# EAGLE design Control pHAT v0.1A (EAGLE 9.3.1)
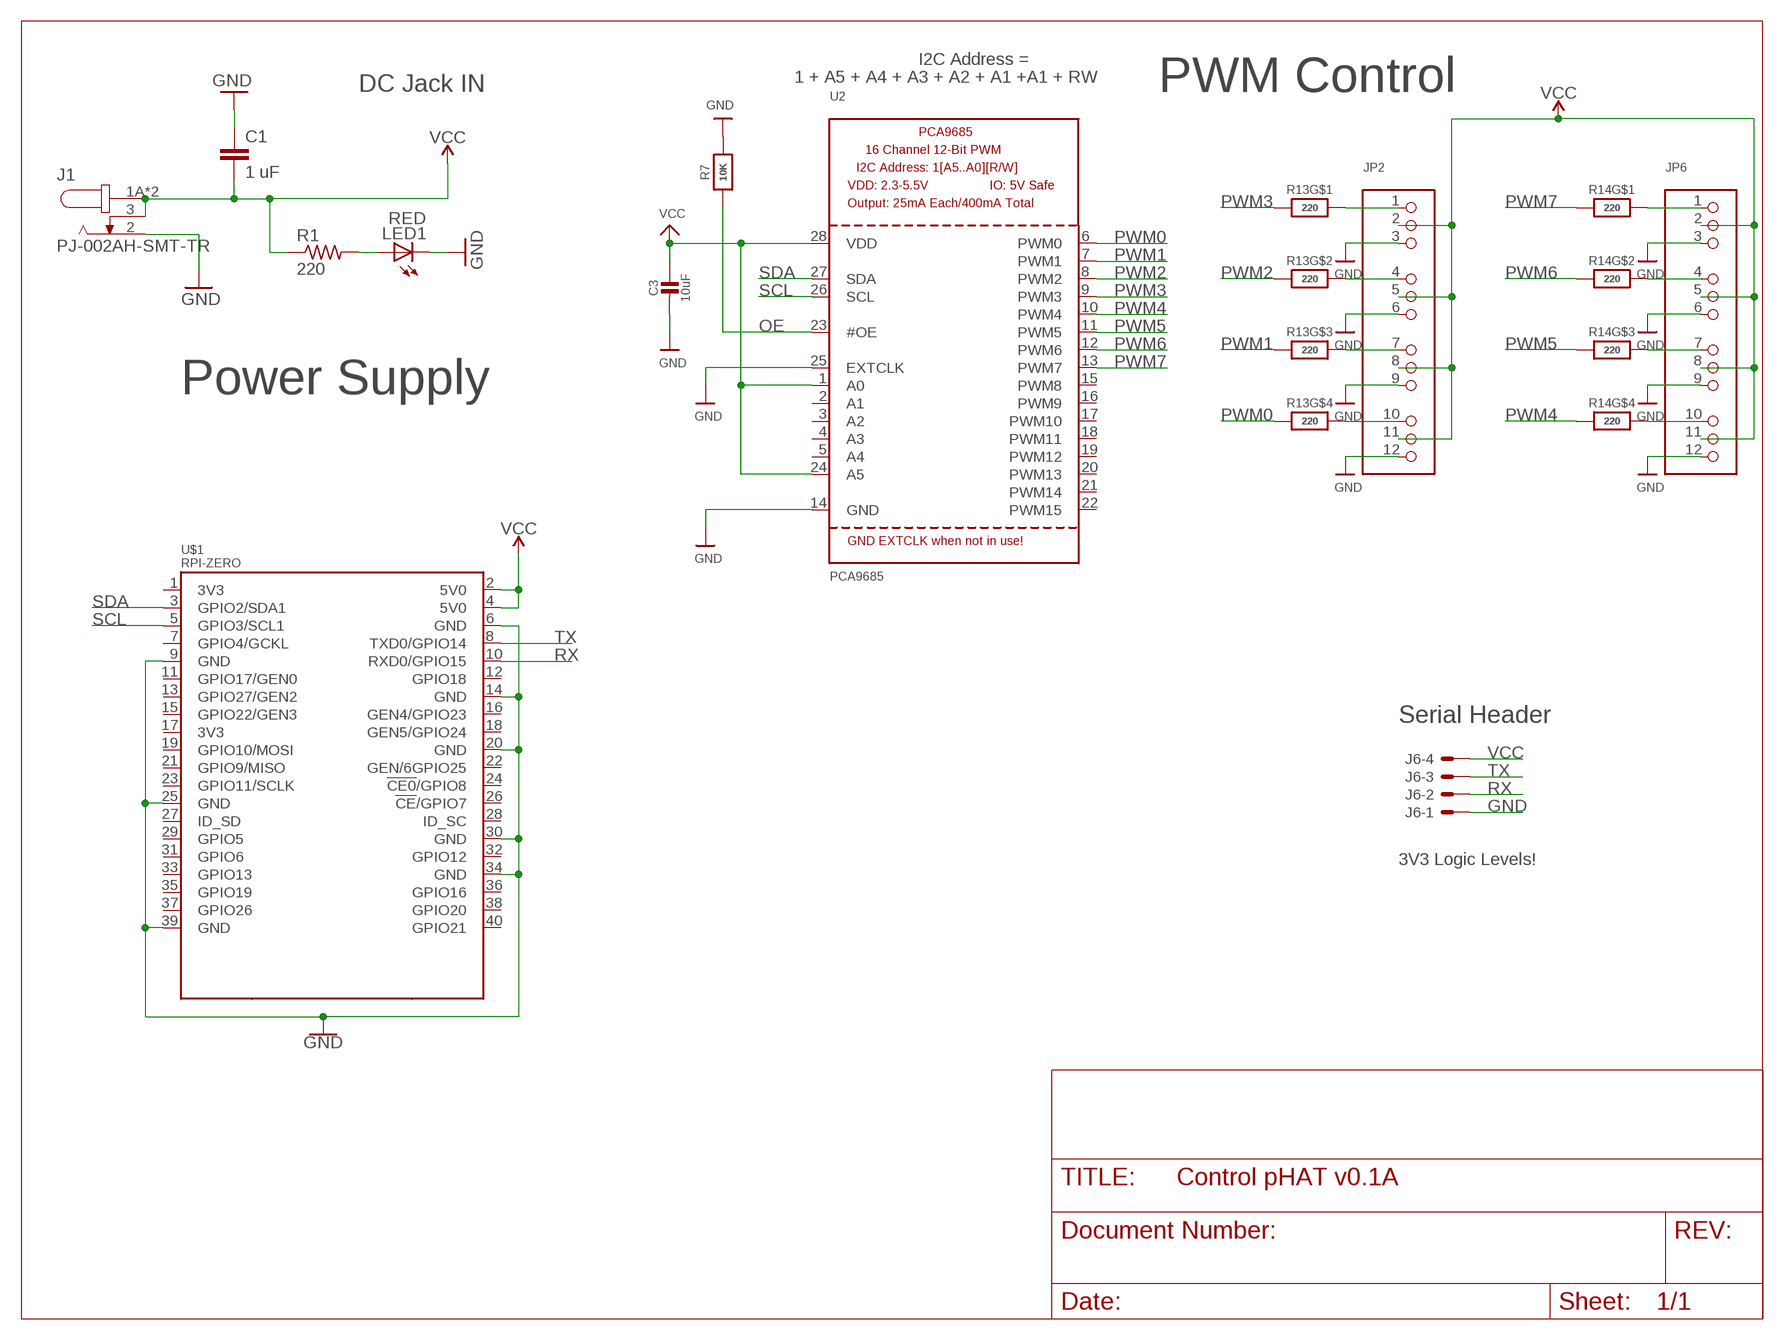
[diagram p0: schematic, sheet 1]

## Parts
C1  1 uF  C-EUC0603  [C0603]
C3  10uF  CAP_CERAMIC0805-NOOUTLINE  [0805-NO]
J1  PJ-002AH-SMT-TR  [CUI_PJ-002AH-SMT-TR]
J6  JST-XH-04-PIN-LONG-PAD  [JST-XH-04-PACKAGE-LONG-PAD]
JP2  HEADER-3X04  [3X04]
JP6  HEADER-3X04  [3X04]
LED1  RED  LEDCHIP-LED0603  [CHIP-LED0603]
R1  220  R-US_M1206  [M1206]
R7  10K  RESISTOR0805_NOOUTLINE  [0805-NO]
R13  220  RESISTOR_4PACK  [RESPACK_4X0603]
R14  220  RESISTOR_4PACK  [RESPACK_4X0603]
U2  PCA9685  [TSSOP28]
U$1  RPI-ZERO  [RASPBERRYPI_BASTELSTUBE_V13_RASPI_BOARD_B+_FULL]

## Nets
GND: C1.1 C3.2 J1.2 J6.1 JP2.3 JP2.6 JP2.9 JP2.12 JP6.3 JP6.6 JP6.9 JP6.12 LED1.C R7.2 U2.14(GND) U2.25(EXTCLK)
GND@1: U$1.6(GND) U$1.9(GND) U$1.14(GND) U$1.20(GND) U$1.25(GND) U$1.30(GND) U$1.34(GND) U$1.39(GND) ; supply symbol labelled GND
N$3: JP2.1 R13.8
N$4: LED1.A R1.2
N$5: JP2.4 R13.7
N$9: JP2.7 R13.6
N$10: JP2.10 R13.5
N$11: JP6.10 R14.5
N$12: JP6.7 R14.6
N$13: JP6.4 R14.7
N$14: JP6.1 R14.8
OE: R7.1 U2.23(#OE)
PWM0: R13.4 U2.6(PWM0)
PWM1: R13.3 U2.7(PWM1)
PWM2: R13.2 U2.8(PWM2)
PWM3: R13.1 U2.9(PWM3)
PWM4: R14.4 U2.10(PWM4)
PWM5: R14.3 U2.11(PWM5)
PWM6: R14.2 U2.12(PWM6)
PWM7: R14.1 U2.13(PWM7)
RX: J6.2 U$1.10(RXD0/GPIO15)
SCL: U2.26(SCL) U$1.5(GPIO3/SCL1)
SDA: U2.27(SDA) U$1.3(GPIO2/SDA1)
TX: J6.3 U$1.8(TXD0/GPIO14)
VCC: C1.2 C3.1 J1.1A J1.1B J1.3 J6.4 JP2.2 JP2.5 JP2.8 JP2.11 JP6.2 JP6.5 JP6.8 JP6.11 R1.1 U2.1(A0) U2.24(A5) U2.28(VDD) U$1.2(5V0) U$1.4(5V0)
Unconnected: U2.2(A1) U2.3(A2) U2.4(A3) U2.5(A4) U2.15(PWM8) U2.16(PWM9) U2.17(PWM10) U2.18(PWM11) U2.19(PWM12) U2.20(PWM13) U2.21(PWM14) U2.22(PWM15) U$1.1(3V3) U$1.7(GPIO4/GCKL) U$1.11(GPIO17/GEN0) U$1.12(GPIO18) U$1.13(GPIO27/GEN2) U$1.15(GPIO22/GEN3) U$1.16(GEN4/GPIO23) U$1.17(3V3) U$1.18(GEN5/GPIO24) U$1.19(GPIO10/MOSI) U$1.21(GPIO9/MISO) U$1.22(GEN/6GPIO25) U$1.23(GPIO11/SCLK) U$1.24(!CE0!/GPIO8) U$1.26(!CE!/GPIO7) U$1.27(ID_SD) U$1.28(ID_SC) U$1.29(GPIO5) U$1.31(GPIO6) U$1.32(GPIO12) U$1.33(GPIO13) U$1.35(GPIO19) U$1.36(GPIO16) U$1.37(GPIO26) U$1.38(GPIO20) U$1.40(GPIO21)

## Notes on the sheet
- I2C Address =
- 1 + A5 + A4 + A3 + A2 + A1 +A1 + RW
- DC Jack IN | PWM Control
- Power Supply
- Serial Header
- 3V3 Logic Levels!

## Library data of the parts
C1 = rcl:C-EU: CAPACITOR, European symbol; SPICEPREFIX: C
C3 = microbuilder:CAP_CERAMIC: Ceramic Capacitors For new designs, use the packages preceded by an '_' character since they are more reliable: The following footprints should be used on most boards: _0402 - Standard footprint for regular board layouts _0603 - Standard footprint for regular board layouts _0805 - Standard footprint for regular board layouts _1206 - Standard footprint for regular board layouts For extremely tight-pitch boards where space is at a premium, the following 'micro-pitch' footprints can be used (smaller pads, no silkscreen outline, etc.): _0402MP - Micro-pitch footprint for very dense/compact boards _0603MP - Micro-pitch footprint for very dense/compact boards _0805MP - Micro-pitch footprint for very dense/compact boards _1206MP - Micro-pitch footprint for very dense/compact boards
J1 = PJ-002AH-SMT-TR:PJ-002AH-SMT-TR: 2.0 mm Center Pin, 5.0 A, Right Angle, Surface Mount (SMT), Dc Power Jack Connector; CUI_PURCHASE_URL: https://www.cui.com/product/interconnect/dc-power-connectors/jacks/2.0-mm-center-pin/pj-002ah-smt-tr?utm_source=snapeda.com&utm_medium=referral&utm_campaign=snapedaBOM; DESCRIPTION: 24 VDC 5 A Surface Mount Unshielded 2 Conductors 3 Contacts Male Power Jack; DIGI-KEY_PART_NUMBER: CP-002AHPJCT-ND; DIGI-KEY_PURCHASE_URL: https://www.digikey.com/product-detail/en/cui-inc/PJ-002AH-SMT-TR/CP-002AHPJCT-ND/669692?utm_source=snapeda&utm_medium=aggregator&utm_campaign=symbol; MF: CUI Inc.; MP: PJ-002AH-SMT-TR; PACKAGE: None
J6 = JST XH Connectors v1-0:JST-XH-04-PIN: JST XH Connector 2 Pin Wire to board connector. Pitch: 2,54 mm, (0.100") Number of pins: 4 Created by Rembrandt Electronics www.rembrandtelectronics.com
JP2 JP6 = microbuilder:HEADER-3X04
LED1 = led:LED: LED OSRAM: - CHIPLED LG R971, LG N971, LY N971, LG Q971, LY Q971, LO R971, LY R971 LH N974, LH R974 LS Q976, LO Q976, LY Q976 LO Q996 - Hyper CHIPLED LW Q18S LB Q993, LB Q99A, LB R99A - SideLED LS A670, LO A670, LY A670, LG A670, LP A670 LB A673, LV A673, LT A673, LW A673 LH A674 LY A675 LS A676, LA A676, LO A676, LY A676, LW A676 LS A679, LY A679, LG A679 - Hyper Micro SIDELED® LS Y876, LA Y876, LO Y876, LY Y876 LT Y87S - SmartLED LW L88C, LW L88S LB L89C, LB L89S, LG L890 LS L89K, LO L89K, LY L89K LS L896, LA L896, LO L896, LY L896 - TOPLED LS T670, LO T670, LY T670, LG T670, LP T670 LSG T670, LSP T670, LSY T670, LOP T670, LYG T670 LG T671, LOG T671, LSG T671 LB T673, LV T673, LT T673, LW T673 LH T674 LS T676, LA T676, LO T676, LY T676, LB T676, LH T676, LSB T676, LW T676 LB T67C, LV T67C, LT T67C, LS T67K, LO T67K, LY T67K, LW E67C LS E67B, LA E67B, LO E67B, LY E67B, LB E67C, LV E67C, LT E67C LW T67C LS T679, LY T679, LG T679 LS T770, LO T770, LY T770, LG T770, LP T770 LB T773, LV T773, LT T773, LW T773 LH T774 LS E675, LA E675, LY E675, LS T675 LS T776, LA T776, LO T776, LY T776, LB T776 LHGB T686 LT T68C, LB T68C - Hyper Mini TOPLED® LB M676 - Mini TOPLED Santana® LG M470 LS M47K, LO M47K, LY M47K Source: http://www.osram.convergy.de LUXEON: - LUMILED® LXK2-PW12-R00, LXK2-PW12-S00, LXK2-PW14-U00, LXK2-PW14-V00 LXK2-PM12-R00, LXK2-PM12-S00, LXK2-PM14-U00 LXK2-PE12-Q00, LXK2-PE12-R00, LXK2-PE12-S00, LXK2-PE14-T00, LXK2-PE14-U00 LXK2-PB12-K00, LXK2-PB12-L00, LXK2-PB12-M00, LXK2-PB14-N00, LXK2-PB14-P00, LXK2-PB14-Q00 LXK2-PR12-L00, LXK2-PR12-M00, LXK2-PR14-Q00, LXK2-PR14-R00 LXK2-PD12-Q00, LXK2-PD12-R00, LXK2-PD12-S00 LXK2-PH12-R00, LXK2-PH12-S00 LXK2-PL12-P00, LXK2-PL12-Q00, LXK2-PL12-R00 Source: www.luxeon.com KINGBRIGHT: KA-3528ASYC Source: www.kingbright.com
R1 = resistor:R-US_: RESISTOR, American symbol
R7 = microbuilder:RESISTOR: Resistors For new designs, use the packages preceded by an '_' character since they are more reliable: The following footprints should be used on most boards: _0402 - Standard footprint for regular board layouts _0603 - Standard footprint for regular board layouts _0805 - Standard footprint for regular board layouts _1206 - Standard footprint for regular board layouts For extremely tight-pitch boards where space is at a premium, the following 'micro-pitch' footprints can be used (smaller pads, no silkscreen outline, etc.): _0402MP - Micro-pitch footprint for very dense/compact boards _0603MP - Micro-pitch footprint for very dense/compact boards _0805MP - Micro-pitch footprint for very dense/compact boards _1206MP - Micro-pitch footprint for very dense/compact boards
R13 R14 = microbuilder:RESISTOR_4PACK: Resistor Packs (4 resistors) 4 x 0603 10K 1/16W - Digikey: YC164J-10KCT-ND
U2 = microbuilder:PCA9685: PCA9685 - 16 Channel 12-Bit I2C PWM Controller 5.0V tolerant 16 channel, 12-bit I2C PWM controller with 25mA per output (max. 400mA total) Digikey: 568-5931-1-ND
U$1 = RPI-Zero:RPI-ZERO

## Board
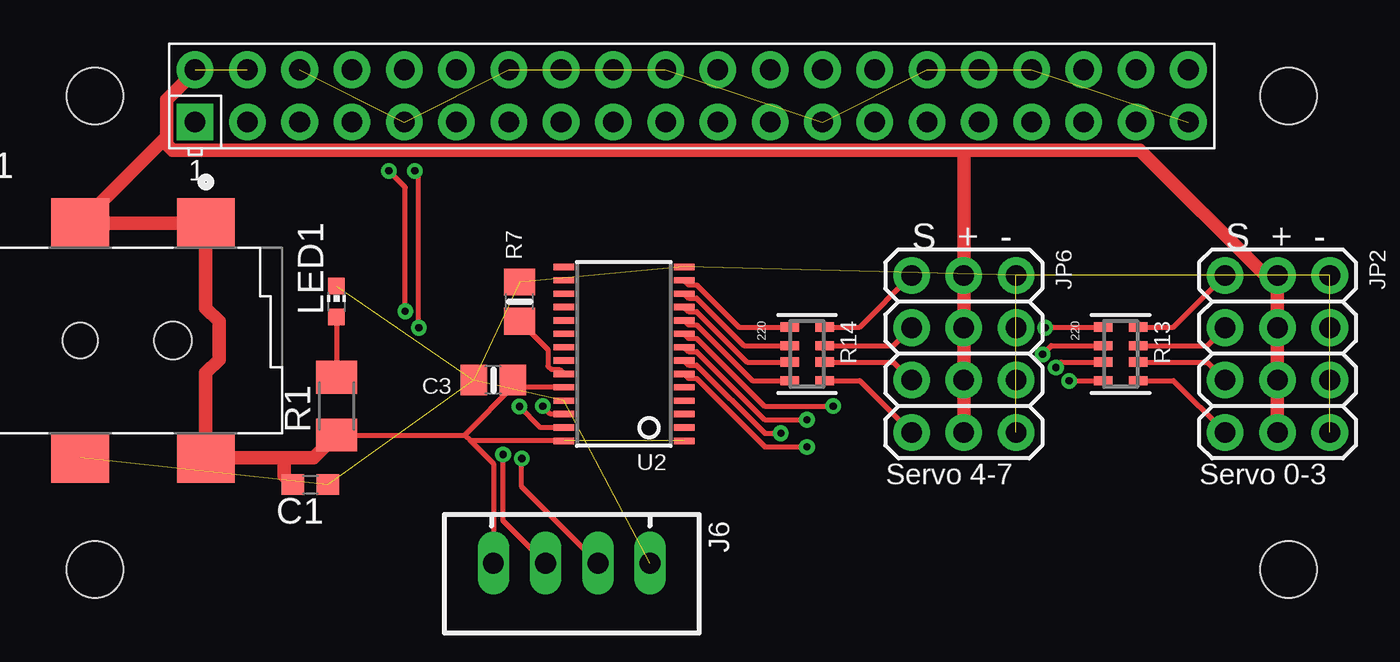
[diagram p1: board, top side]
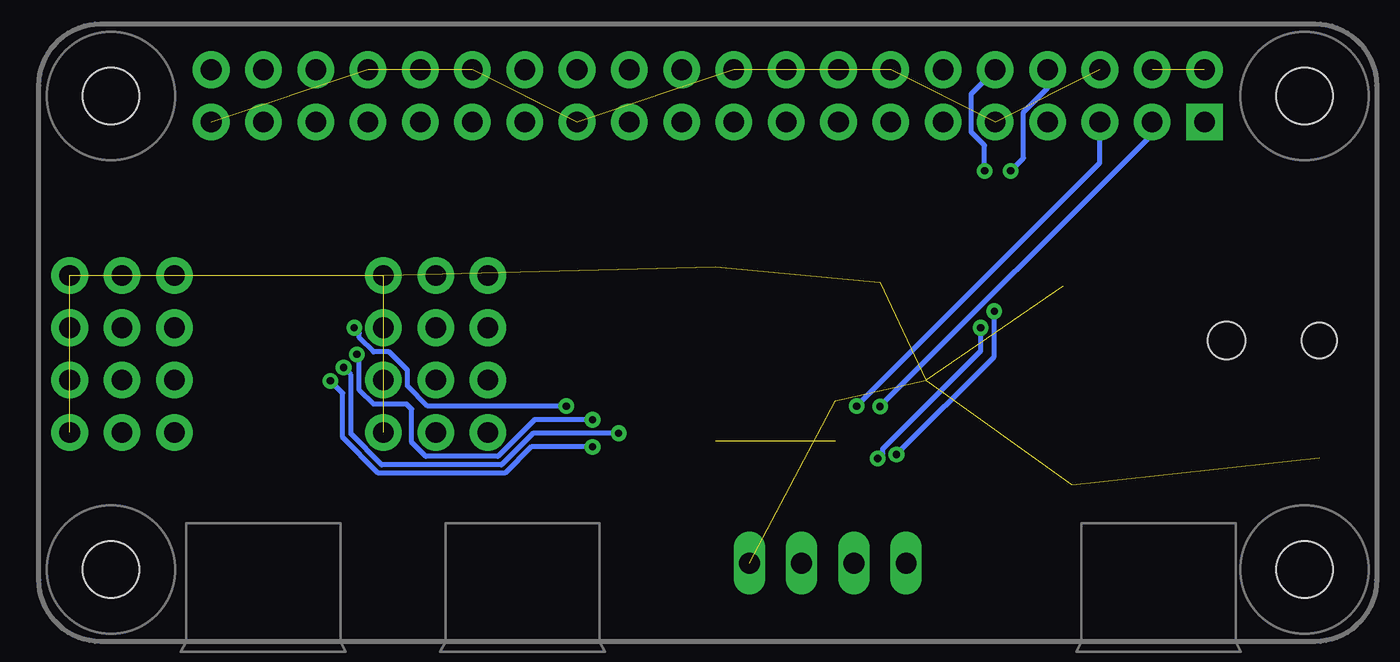
[diagram p2: board, bottom side, seen from below]

No outline drawn. Coordinates in mm, seen from the top.
Copper layers (1*16): Top 0.035mm / dielectric 1.5mm / Bottom 0.035mm
Design rules "default": minimum track width 6mil, minimum drill 0.35mm, track to track 6mil, track to pad 6mil, pad to pad 6mil, via to via 6mil, smd to smd 6mil, copper to edge 40mil, drill to drill 6mil, minimum pad ring 10mil, minimum via ring 8mil, stop-mask expansion 4mil, vias tented up to drill 0mil, thermal gap 10mil

### Footprints (pad centres in the part's own frame; a part is rotated, then mirrored left to right if it is on the bottom)
C0603 = smd 1.1 x 1: 1 -0.85,0; 2 0.85,0
0805-NO = smd 1.3 x 1.5: 1 -0.95,0; 2 0.95,0
CUI_PJ-002AH-SMT-TR = smd 2.8 x 2.4: 1A 0,0; 1B -6.1,0; 2 -6.1,-11.4; 3 0,-11.4 | hole 1.7: -6.1,-5.7 | hole 1.8: -1.6,-5.7
JST-XH-04-PACKAGE-LONG-PAD = drill 1.016 long: 1 -3.81,0; 2 -1.27,0; 3 1.27,0; 4 3.81,0
3X04 = drill 1 pad 1.778: 1 -3.81,-2.54; 2 -3.81,0; 3 -3.81,2.54; 4 -1.27,-2.54; 5 -1.27,0; 6 -1.27,2.54; 7 1.27,-2.54; 8 1.27,0; 9 1.27,2.54; 10 3.81,-2.54; 11 3.81,0; 12 3.81,2.54
CHIP-LED0603 = smd 0.8 x 0.8: A 0,-0.75; C 0,0.75
M1206 = smd 1.6 x 2: 1 -1.4,0; 2 1.4,0
RESPACK_4X0603 = smd 0.45 x 0.9: 1 -1.3,-0.85; 2 -0.4,-0.85; 3 0.4,-0.85; 4 1.3,-0.85; 5 1.3,0.85; 6 0.4,0.85; 7 -0.4,0.85; 8 -1.3,0.85
TSSOP28 = smd 0.305 x 0.991: 1 -4.225,-2.918; 2 -3.575,-2.918; 3 -2.925,-2.918; 4 -2.275,-2.918; 5 -1.625,-2.918; 6 -0.975,-2.918; 7 -0.325,-2.918; 8 0.325,-2.918; 9 0.975,-2.918; 10 1.625,-2.918; 11 2.275,-2.918; 12 2.925,-2.918; 13 3.575,-2.918; 14 4.225,-2.918; 15 4.225,2.918; 16 3.575,2.918; 17 2.925,2.918; 18 2.275,2.918; 19 1.625,2.918; 20 0.975,2.918; 21 0.325,2.918; 22 -0.325,2.918; 23 -0.975,2.918; 24 -1.625,2.918; 25 -2.275,2.918; 26 -2.925,2.918; 27 -3.575,2.918; 28 -4.225,2.918
RASPBERRYPI_BASTELSTUBE_V13_RASPI_BOARD_B+_FULL = drill 1 pad 1.778 square: 1 8.37,25.23 | drill 1 pad 1.778: 2 8.37,27.77; 3 10.91,25.23; 4 10.91,27.77; 5 13.45,25.23; 6 13.45,27.77; 7 15.99,25.23; 8 15.99,27.77; 9 18.53,25.23; 10 18.53,27.77; 11 21.07,25.23; 12 21.07,27.77; 13 23.61,25.23; 14 23.61,27.77; 15 26.15,25.23; 16 26.15,27.77; 17 28.69,25.23; 18 28.69,27.77; 19 31.23,25.23; 20 31.23,27.77; 21 33.77,25.23; 22 33.77,27.77; 23 36.31,25.23; 24 36.31,27.77; 25 38.85,25.23; 26 38.85,27.77; 27 41.39,25.23; 28 41.39,27.77; 29 43.93,25.23; 30 43.93,27.77; 31 46.47,25.23; 32 46.47,27.77; 33 49.01,25.23; 34 49.01,27.77; 35 51.55,25.23; 36 51.55,27.77; 37 54.09,25.23; 38 54.09,27.77; 39 56.63,25.23; 40 56.63,27.77 | hole 2.75: 3.5,3.5; 3.5,26.5; 61.5,3.5; 61.5,26.5

### Placement (x,y rotation side)
C1  2.54,-41.91 180 top
C3  11.43,-36.83 180 top
J1  -2.54,-29.21 0 top
J6  15.24,-45.72 180 top
JP2  49.53,-35.56 270 top
JP6  34.29,-35.56 270 top
LED1  3.81,-33.02 0 top
R1  3.81,-38.1 90 top
R7  12.7,-33.02 90 top
R13  41.91,-35.56 270 top
R14  26.67,-35.56 270 top
U2  17.78,-35.56 90 top
U$1  -11.43,-49.53 0 top

### Tracks (layer width: path | path; a pad name or v marks a point on that pad's centre or on a via)
GND  (15 unrouted)
GND@1  (7 unrouted)
N$3
  Top 0.254: R13.8 44.48,-34.26 JP2.1
N$4
  Top 0.254: LED1.A R1.2
N$5
  Top 0.254: R13.7 46.12,-35.16 JP2.4
N$9
  Top 0.254: R13.6 46.12,-35.96 JP2.7
N$10
  Top 0.254: R13.5 44.48,-36.86 JP2.10
N$11
  Top 0.254: R14.5 29.24,-36.86 JP6.10
N$12
  Top 0.254: R14.6 30.88,-35.96 JP6.7
N$13
  Top 0.254: R14.7 30.88,-35.16 JP6.4
N$14
  Top 0.254: R14.8 29.24,-34.26 JP6.1
OE
  Top 0.254: R7.1 14.09,-35.36 14.09,-36.15 14.25,-36.32 14.64,-36.32 U2.23
PWM0  (via drill 0.35)
  Top 0.254: U2.6 20.92,-36.75 21.31,-36.75 24.63,-40.07 v26.67,-40.07 | v39.41,-36.87 v39.41,-36.86 R13.4
  Bottom 0.254: v26.67,-40.07 29.65,-40.07 30.93,-41.35 37.08,-41.35 38.81,-39.62 38.81,-37.46 v39.41,-36.87
PWM1  (via drill 0.35)
  Top 0.254: U2.7 20.92,-36.1 21.31,-36.1 24.62,-39.41 v25.4,-39.41 | v38.76,-36.22 39.03,-35.96 R13.3
  Bottom 0.254: v25.4,-39.41 29.57,-39.41 31.1,-40.95 36.91,-40.95 38.41,-39.45 38.41,-36.58 v38.76,-36.22
PWM2  (via drill 0.35)
  Top 0.254: U2.8 20.92,-35.45 21.31,-35.45 24.61,-38.76 v26.67,-38.76 | v38.12,-35.58 38.54,-35.16 R13.2
  Bottom 0.254: v26.67,-38.76 29.48,-38.76 31.27,-40.54 34.77,-40.54 35.46,-39.85 35.46,-38.24 35.7,-38 37.31,-38 38,-37.31 38,-35.7 v38.12,-35.58
PWM3  (via drill 0.35)
  Top 0.254: U2.9 20.92,-34.8 21.31,-34.8 24.61,-38.1 v27.94,-38.1 | v38.25,-34.29 38.28,-34.26 R13.1
  Bottom 0.254: v38.25,-34.29 38,-34.54 38,-34.77 37.31,-35.46 36.55,-35.46 35.66,-36.35 35.66,-37.11 34.67,-38.1 v27.94,-38.1
PWM4
  Top 0.254: U2.10 20.92,-34.15 21.31,-34.15 24.02,-36.86 R14.4
PWM5
  Top 0.254: U2.11 20.92,-33.5 21.31,-33.5 23.77,-35.96 R14.3
PWM6
  Top 0.254: U2.12 20.92,-32.85 21.31,-32.85 23.62,-35.16 R14.2
PWM7
  Top 0.254: U2.13 20.92,-32.2 21.31,-32.2 23.37,-34.26 R14.1
RX  (via drill 0.35)
  Top 0.254: J6.2 12.81,-42.02 v12.81,-40.64 | v7.81,-34.29 7.81,-26.86 v7.62,-26.67
  Bottom 0.254: v12.81,-40.64 12.56,-40.39 12.56,-40.17 7.81,-35.42 v7.81,-34.29 | v7.62,-26.67 7.62,-25.43 8.27,-24.78 8.27,-22.93 U$1.10
SCL  (via drill 0.35)
  Top 0.254: U2.26 14.22,-38.48 v13.84,-38.1
  Bottom 0.254: v13.84,-38.1 2.02,-26.28 U$1.5
SDA  (via drill 0.35)
  Top 0.254: U2.27 13.72,-39.13 v12.7,-38.11
  Bottom 0.254: v12.7,-38.11 -0.52,-24.89 U$1.3
TX  (via drill 0.35)
  Top 0.254: J6.3 11.9,-43.65 v11.9,-40.44 | v7.15,-33.49 7.15,-27.47 v6.35,-26.67
  Bottom 0.254: v11.9,-40.44 7.15,-35.69 v7.15,-33.49 | v6.35,-26.67 5.73,-26.05 5.73,-23.82 4.56,-22.65 U$1.8
VCC  (2 unrouted)
  Top 0.254: U2.24 12.73,-37.19 12.54,-36.99 | 12.54,-36.99 C3.1 | R1.1 10.03,-39.5 | 10.03,-39.5 12.54,-36.99 | 10.31,-39.78 11.43,-40.9 J6.4 | U2.28 10.31,-39.78 | 10.31,-39.78 10.03,-39.5
  Top 0.66: -4.43,-25 -4.43,-23.21 -3.06,-21.84 U$1.2 | -4.43,-25 J1.1B J1.1A -2.54,-33.33 -1.89,-33.98 -1.89,-35.84 -2.54,-36.49 J1.3 1.27,-40.61 | JP2.11 JP2.8 JP2.5 JP2.2 48.93,-31.75 42.85,-25.67 34.29,-25.67 | JP6.11 JP6.8 JP6.5 JP6.2 34.29,-25.67 | -4.43,-25 -4.43,-25.39 -4.15,-25.67 34.29,-25.67 | 1.27,-40.61 2.7,-40.61 R1.1 | 1.27,-40.61 1.27,-41.49 C1.2

### Text on the board
tSilk: S + - | S + - | Servo 4-7 | Servo 0-3